# Altium schematic sheet Peripherials.SchDoc: Peripherials
size Letter; Date: Jul 31/2018; Revision: 1; SheetNumber: 8; SheetTotal: 9
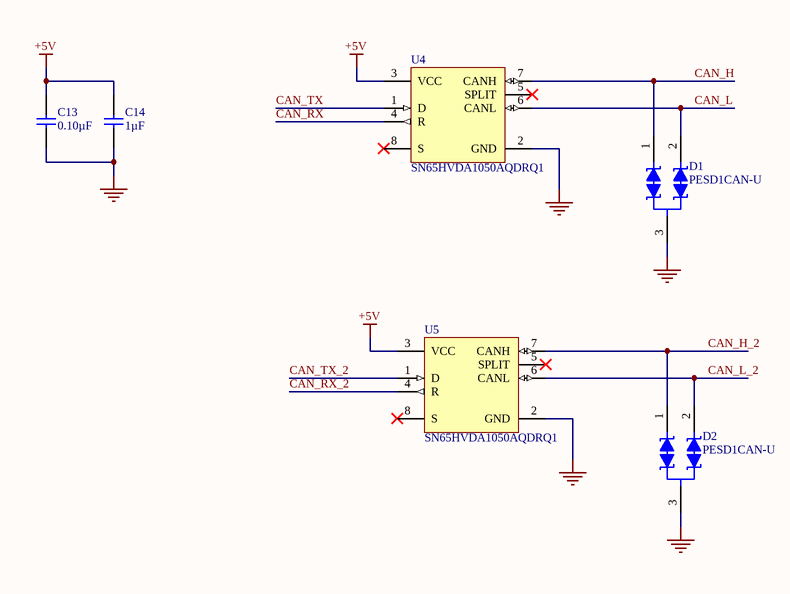
[diagram p0: Peripherials.SchDoc]

## Parts
C13  value 0.10µF  [1206]  (hidden comment: CAP 0.10µF ±10% 16V 0402 X7R)
C14  value 1µF  [1206]  (hidden comment: CAP 1µF ±10% 16V 0805 X7R)
D1  PESD1CAN-U  [SOT65P210X110-3N]
D2  PESD1CAN-U  [SOT65P210X110-3N]
U4  SN65HVDA1050AQDRQ1  [SOIC127P600X175-8M]
U5  SN65HVDA1050AQDRQ1  [SOIC127P600X175-8M]

## Nets
+5V: C13.2 C14.1 U4.3(VCC) U5.3(VCC)
GND: C13.1 C14.2 D1.3 D2.3 U4.2(GND) U5.2(GND)
CAN_H: D1.1 U4.7(CANH)
CAN_H_2: D2.1 U5.7(CANH)
CAN_L: D1.2 U4.6(CANL)
CAN_L_2: D2.2 U5.6(CANL)
CAN_RX: U4.4(R)
CAN_RX_2: U5.4(R)
CAN_TX: U4.1(D)
CAN_TX_2: U5.1(D)

Not connected (* = marked no-connect by the designer): U4 5(SPLIT)* 8(S)*; U5 5(SPLIT)* 8(S)*

## Notes on the sheet
- Date:
- Revision:
- Sheet:
- /

## Library data of the parts
C13 = CC0402KRX7R7BB104: Manufacturer: Yageo; Manufacturer Series: CC; Part Number: CC0402KRX7R7BB104; Component Type: Standard; Tolerance: ±10%; Voltage: 16V; Package: 0402; Temperature Coefficient: X7R; Temperature Range: -55°C ~ 125°C; Supplier 1: Digi-Key; Supplier Part Number 1: 311-1338-1-ND
C14 = CC0805KKX7R7BB105: Manufacturer: Yageo; Manufacturer Series: CC; Part Number: CC0805KKX7R7BB105; Component Type: Standard; Tolerance: ±10%; Voltage: 16V; Package: 0805; Temperature Coefficient: X7R; Temperature Range: -55°C ~ 125°C; Supplier 1: Digi-Key; Supplier Part Number 1: 311-1365-1-ND
U4 U5 = SN65HVDA1050AQDRQ1: CAN transceiver; Supplier 1: Digi-Key; Supplier Part Number 1: 296-25836-1-ND